# Altium schematic sheet Power_Middle.SchDoc
size A4; SheetNumber: 1; SheetTotal: 3
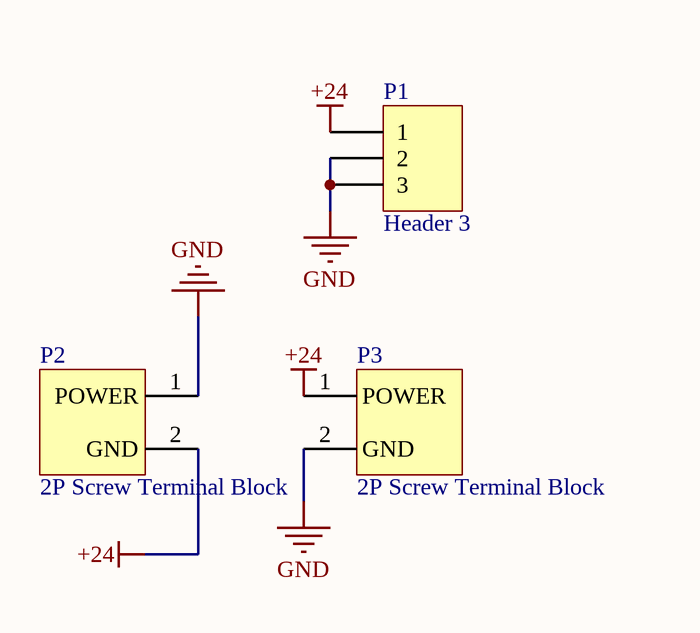
[diagram p0: Power_Middle.SchDoc]

## Parts
P1  Header 3  [HDR1X3]
P2  2P Screw Terminal Block  [P_Terminal block 3.5mm-pitch]
P3  2P Screw Terminal Block  [P_Terminal block 3.5mm-pitch]

## Nets
+24: P1.1 P2.2(GND) P3.1(POWER)
GND: P1.2 P1.3 P2.1(POWER) P3.2(GND)

## Library data of the parts
P1 = Header 3: Header, 3-Pin; LatestRevisionDate: 17-Jul-2002; LatestRevisionNote: Re-released for DXP Platform.; Publisher: Altium Limited
P2 P3 = P_Terminal block: Green Straight pin 3.5mm  pitch; P=3.5mm  Screw terminal ROHS; MFR Part #: KF350-3.5-2P; Manufacturer: Cixi Kefa Elec; LCSC Part#: C474892; DataSheet: https://datasheet.lcsc.com/lcsc/2001160007_Cixi-Kefa-Elec-KF350-3-5-2P_C474892.pdf